# Altium schematic sheet Dig_Encoder_Interface.SchDoc
size A; SheetNumber: 5; SheetTotal: 5
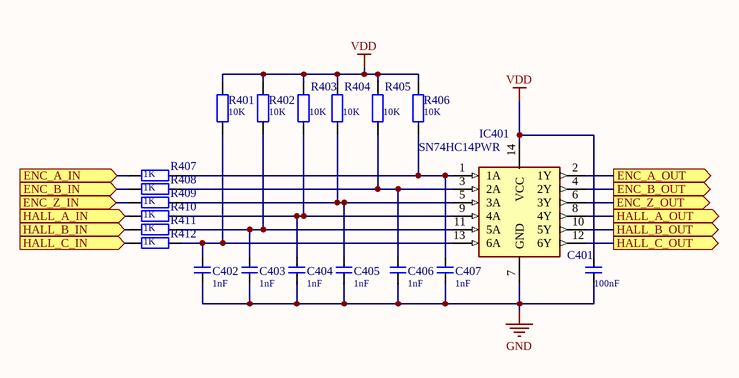
[diagram p0: Dig_Encoder_Interface.SchDoc]

## Parts
C401  value 100nF  [CAPC1005X06N]  (hidden comment: Cap)
C402  value 1nF  [CAPC1005X06N]  (hidden comment: Cap)
C403  value 1nF  [CAPC1005X06N]  (hidden comment: Cap)
C404  value 1nF  [CAPC1005X06N]  (hidden comment: Cap)
C405  value 1nF  [CAPC1005X06N]  (hidden comment: Cap)
C406  value 1nF  [CAPC1005X06N]  (hidden comment: Cap)
C407  value 1nF  [CAPC1005X06N]  (hidden comment: Cap)
IC401  SN74HC14PWR  [SOP65P640X120-14N]
R401  value 10K  [RESC1005X04N]  (hidden comment: R)
R402  value 10K  [RESC1005X04N]  (hidden comment: R)
R403  value 10K  [RESC1005X04N]  (hidden comment: R)
R404  value 10K  [RESC1005X04N]  (hidden comment: R)
R405  value 10K  [RESC1005X04N]  (hidden comment: R)
R406  value 10K  [RESC1005X04N]  (hidden comment: R)
R407  value 1K  [RESC1005X04N]  (hidden comment: R)
R408  value 1K  [RESC1005X04N]  (hidden comment: R)
R409  value 1K  [RESC1005X04N]  (hidden comment: R)
R410  value 1K  [RESC1005X04N]  (hidden comment: R)
R411  value 1K  [RESC1005X04N]  (hidden comment: R)
R412  value 1K  [RESC1005X04N]  (hidden comment: R)

## Ports
ENC_A_IN (in, see Main_CPU[4B]), ENC_A_OUT (out, see Main_CPU[5B]), ENC_B_IN (in, see Main_CPU[4B]), ENC_B_OUT (out, see Main_CPU[5B]), ENC_Z_IN (in, see Main_CPU[4B]), ENC_Z_OUT (out, see Main_CPU[5B]), HALL_A_IN (in, see Main_CPU[4C]), HALL_A_OUT (out, see Main_CPU[5C]), HALL_B_IN (in, see Main_CPU[4C]), HALL_B_OUT (out, see Main_CPU[5C]), HALL_C_IN (in, see Main_CPU[4C]), HALL_C_OUT (out, see Main_CPU[5C])

## Nets
GND: C401.1 C402.1 C403.1 C404.1 C405.1 C406.1 C407.1 IC401.7(GND)
VDD: C401.2 IC401.14(VCC) R401.2 R402.2 R403.2 R404.2 R405.2 R406.2
ENC_A_IN: R407.2 ; port ENC_A_IN
ENC_A_OUT: IC401.2(1Y) ; port ENC_A_OUT
ENC_B_IN: R408.2 ; port ENC_B_IN
ENC_B_OUT: IC401.4(2Y) ; port ENC_B_OUT
ENC_Z_IN: R409.2 ; port ENC_Z_IN
ENC_Z_OUT: IC401.6(3Y) ; port ENC_Z_OUT
HALL_A_IN: R410.2 ; port HALL_A_IN
HALL_A_OUT: IC401.8(4Y) ; port HALL_A_OUT
HALL_B_IN: R411.2 ; port HALL_B_IN
HALL_B_OUT: IC401.10(5Y) ; port HALL_B_OUT
HALL_C_IN: R412.2 ; port HALL_C_IN
HALL_C_OUT: IC401.12(6Y) ; port HALL_C_OUT
NetC402_2: C402.2 IC401.13(6A) R401.1 R412.1
NetC403_2: C403.2 IC401.11(5A) R402.1 R411.1
NetC404_2: C404.2 IC401.9(4A) R403.1 R410.1
NetC405_2: C405.2 IC401.5(3A) R404.1 R409.1
NetC406_2: C406.2 IC401.3(2A) R405.1 R408.1
NetC407_2: C407.2 IC401.1(1A) R406.1 R407.1

## Library data of the parts
C401 = Cap: Capacitor; MPN: GCM155R71H104KE02D; Link: https://jlcpcb.com/partdetail/MurataElectronics-GCM155R71H104KE02D/C85858; Price: 0.0031
C402-C407 = Cap: Capacitor; MPN: GRM155R71H102KA01D; Link: https://jlcpcb.com/partdetail/MurataElectronics-GRM155R71H102KA01D/C77018; Price: 0.0016
IC401 = SN74HC14PWR: Integrated Circuit; Manufacturer_Name: Texas Instruments; Datasheet Link: http://www.ti.com/general/docs/suppproductinfo.tsp?distId=10&gotoUrl=http%3A%2F%2Fwww.ti.com%2Flit%2Fgpn%2Fsn74hc14; Height: 1.2mm; MPN: SN74HC14PWR; Mouser Part Number: 595-SN74HC14PWR; Mouser Price/Stock: https://www.mouser.co.uk/ProductDetail/Texas-Instruments/SN74HC14PWR?qs=YEaxc5757jODQ8PDizZzPA%3D%3D; Arrow Part Number: SN74HC14PWR; Arrow Price/Stock: https://www.arrow.com/en/products/sn74hc14pwr/texas-instruments?region=nac; Link: https://jlcpcb.com/partdetail/TexasInstruments-SN74HC14PWR/C6821; Price: 0.1209
R401-R406 = R: Resistor; MPN: RC0402FR-0710KL; Link: https://jlcpcb.com/partdetail/Yageo-RC0402FR0710KL/C60490; Price: 0.0005
R407-R412 = R: Resistor; MPN: RC0402FR-071KL; Link: RC0402FR-071KL; Price: 0.0006